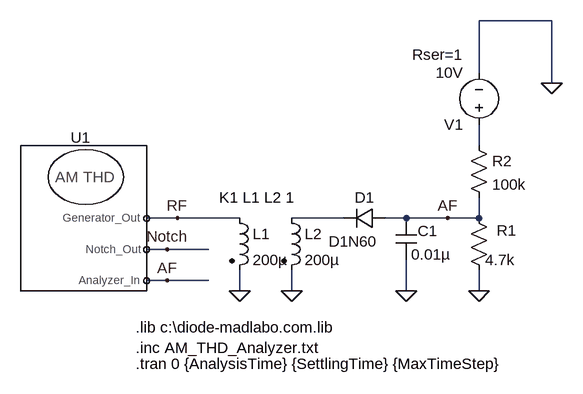
[diagram p0: schematic AM_THD_Analyzer_Test.asc]
AM_THD_Analyzer_Test.asc, the LTspice schematic file:
Version 4
SHEET 1 5108 4212
WIRE -368 -32 -480 -32
WIRE -480 48 -480 -32
WIRE -368 64 -368 -32
WIRE -480 160 -480 128
WIRE -944 272 -992 272
WIRE -848 272 -944 272
WIRE -688 272 -768 272
WIRE -592 272 -624 272
WIRE -528 272 -592 272
WIRE -480 272 -480 240
WIRE -480 272 -528 272
WIRE -960 320 -992 320
WIRE -896 320 -960 320
WIRE -960 368 -992 368
WIRE -896 368 -960 368
WIRE -848 384 -848 352
WIRE -768 384 -768 352
WIRE -592 384 -592 336
WIRE -480 384 -480 352
FLAG -480 384 0
FLAG -592 384 0
FLAG -528 272 AF
FLAG -944 272 RF
FLAG -960 368 AF
FLAG -960 320 Notch
FLAG -368 64 0
FLAG -848 384 0
FLAG -768 384 0
SYMBOL res -464 368 R180
WINDOW 0 -42 77 Left 2
WINDOW 3 -39 32 Left 2
SYMATTR InstName R1
SYMATTR Value 4.7k
SYMBOL cap -608 272 R0
WINDOW 0 34 20 Left 2
SYMATTR InstName C1
SYMATTR Value 0.01µ
SYMBOL diode -624 256 R90
WINDOW 0 0 32 VBottom 2
WINDOW 3 36 50 VTop 2
SYMATTR InstName D1
SYMATTR Value D1N60
SYMBOL AM_THD_Analyzer -1440 288 R0
SYMATTR InstName U1
SYMBOL voltage -480 144 R180
WINDOW 123 0 0 Left 2
WINDOW 39 24 124 Left 2
SYMATTR SpiceLine Rser=1
SYMATTR InstName V1
SYMATTR Value 10V
SYMBOL res -496 144 R0
SYMATTR InstName R2
SYMATTR Value 100k
SYMATTR SpiceLine tol=1 pwr=0.1
SYMBOL ind2 -864 256 R0
SYMATTR InstName L1
SYMATTR Value 200µ
SYMATTR Type ind
SYMATTR SpiceLine Ipk=1 Rser=0.276 Rpar=0 Cpar=0
SYMBOL ind2 -784 256 R0
SYMATTR InstName L2
SYMATTR Value 200µ
SYMATTR Type ind
TEXT -1008 472 Left 2 !.inc AM_THD_Analyzer.txt
TEXT -1008 496 Left 2 !.tran 0 {AnalysisTime} {SettlingTime} {MaxTimeStep}
TEXT -1008 440 Left 2 !.lib c:\\diode-madlabo.com.lib
TEXT -880 240 Left 2 !K1 L1 L2 1

The netlist it stands for:
* AM_THD_Analyzer_Test.asc
R1 0 AF 4.7k
C1 AF 0 0.01µ
D1 AF N002 D1N60
XU1 RF AF Notch AM_THD_Analyzer  ; pins Generator_Out Analyzer_In Notch_Out
V1 N001 0 10V Rser=1
R2 N001 AF 100k tol=1 pwr=0.1
L1 RF 0 200µ Ipk=1 Rser=0.276 Rpar=0 Cpar=0
L2 N002 0 200µ
.model D D
.lib standard.dio
.inc AM_THD_Analyzer.txt
.tran 0 {AnalysisTime} {SettlingTime} {MaxTimeStep}
.lib c:\diode-madlabo.com.lib
K1 L1 L2 1
.backanno
.end